# Altium schematic sheet Sheet1.SchDoc
size A; SheetNumber: 1; SheetTotal: 1
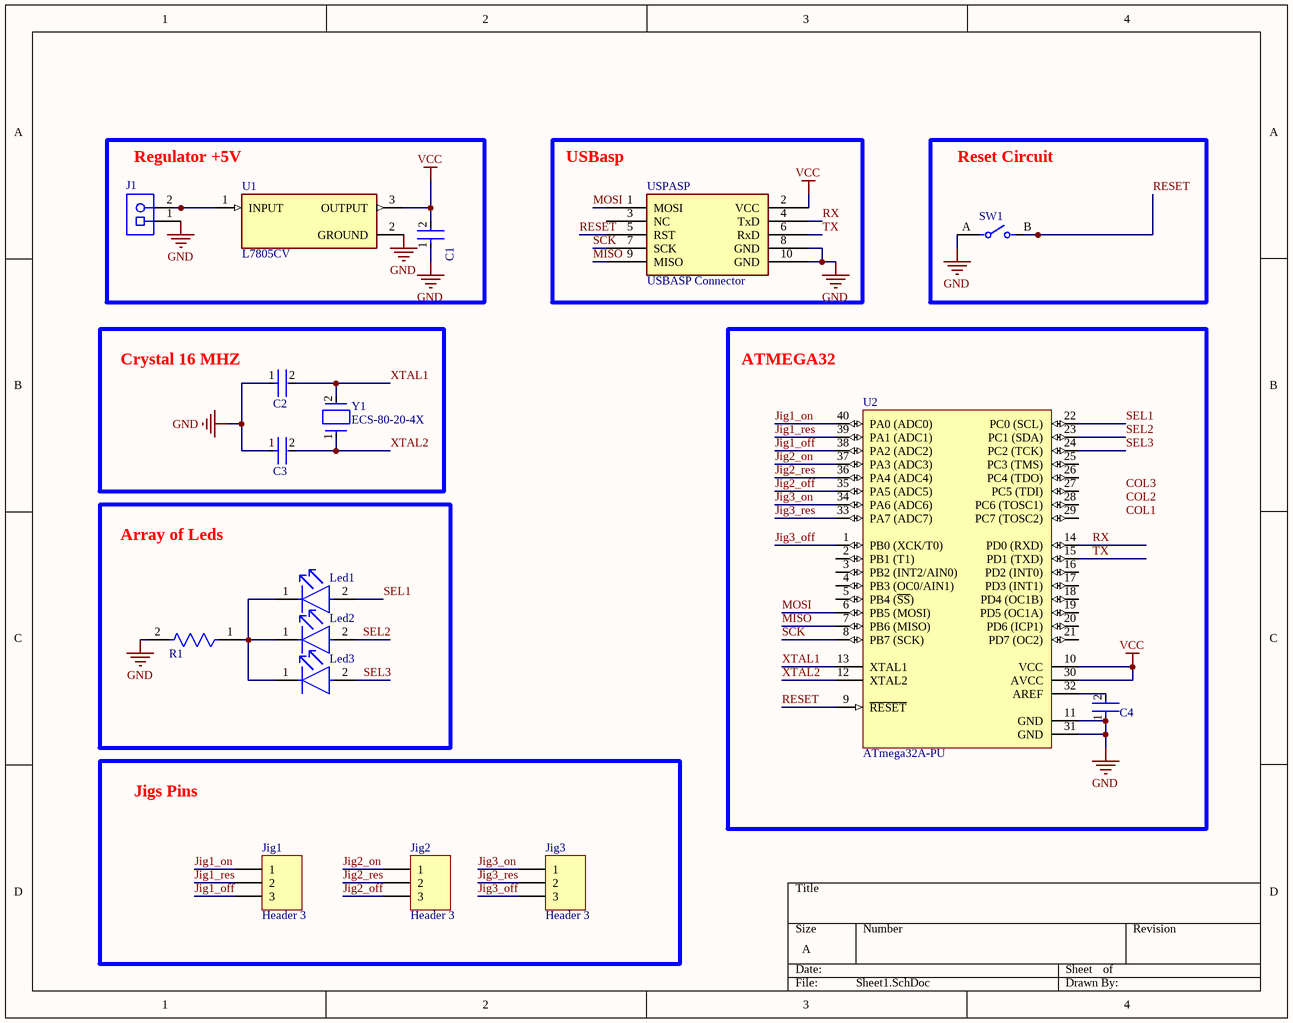
[diagram p0: Sheet1.SchDoc]

## Parts
C1  K103K15X7RF5TL2  [FP-K155L2-MFG]  (value not drawn)
C2  K103K15X7RF5TL2  [FP-K155L2-MFG]  (value not drawn)
C3  K103K15X7RF5TL2  [FP-K155L2-MFG]  (value not drawn)
C4  K103K15X7RF5TL2  [FP-K155L2-MFG]  (value not drawn)
J1  1729128  [PHOE-1729128-2_V]  (value not drawn)
Jig1  Header 3  [HDR1X3]
Jig2  Header 3  [HDR1X3]
Jig3  Header 3  [HDR1X3]
Led1  TLLG4401  [FP-6_544-5255_01-4-MFG]  (value not drawn)
Led2  TLLG4401  [FP-6_544-5255_01-4-MFG]  (value not drawn)
Led3  TLLG4401  [FP-6_544-5255_01-4-MFG]  (value not drawn)
R1  MRS25000C1001FCT00  [FP-MRS25-MFG]  (value not drawn)
SW1  EVQ-21505R  [FP-EVQ-21505R-MFG]  (value not drawn)
U1  L7805CV  [TO255P1040X460X1968-3]
U2  ATmega32A-PU  [40P6]
USPASP  USBASP Connector  [SHDR10W99P254_2X5_2032X889X927P]
Y1  ECS-80-20-4X  [FP-ECS-80-20-4X-MFG]

## Blocks framed on the sheet
Regulator +5V: C1 J1 U1
USBasp: USPASP
Reset Circuit: SW1
Crystal 16 MHZ: C2 C3 Y1
ATMEGA32: C4 U2
Array of Leds: Led1-Led3 R1
Jigs Pins: Jig1-Jig3

## Nets
GND: C1.1 C2.1 C3.1 C4.1 J1.1 R1.2 SW1.A U1.2(GROUND) U2.11(GND) U2.31(GND) USPASP.8(GND) USPASP.10(GND)
VCC: C1.2 U1.3(OUTPUT) U2.10(VCC) U2.30(AVCC) USPASP.2(VCC)
Jig1_off: Jig1.3 U2.38(PA2_(ADC2))
Jig1_on: Jig1.1 U2.40(PA0_(ADC0))
Jig1_res: Jig1.2 U2.39(PA1_(ADC1))
Jig2_off: Jig2.3 U2.35(PA5_(ADC5))
Jig2_on: Jig2.1 U2.37(PA3_(ADC3))
Jig2_res: Jig2.2 U2.36(PA4_(ADC4))
Jig3_off: Jig3.3 U2.1(PB0_(XCK/T0))
Jig3_on: Jig3.1 U2.34(PA6_(ADC6))
Jig3_res: Jig3.2 U2.33(PA7_(ADC7))
MISO: U2.7(PB6_(MISO)) USPASP.9(MISO)
MOSI: U2.6(PB5_(MOSI)) USPASP.1(MOSI)
RESET: SW1.B U2.9(~{RESET}) USPASP.5(RST)
RX: U2.14(PD0_(RXD)) USPASP.4(TxD)
SCK: U2.8(PB7_(SCK)) USPASP.7(SCK)
SEL1: Led1.2(A) U2.22(PC0_(SCL))
SEL2: Led2.2(A) U2.23(PC1_(SDA))
SEL3: Led3.2(A) U2.24(PC2_(TCK))
TX: U2.15(PD1_(TXD)) USPASP.6(RxD)
XTAL1: C2.2 U2.13(XTAL1) Y1.2
XTAL2: C3.2 U2.12(XTAL2) Y1.1
NetC4_2: C4.2 U2.32(AREF)
NetJ1_2: J1.2 U1.1(INPUT)
NetLed1_1: Led1.1(C) Led2.1(C) Led3.1(C) R1.1

Not connected (* = marked no-connect by the designer): U2 2(PB1_(T1)) 3(PB2_(INT2/AIN0)) 4(PB3_(OC0/AIN1)) 5(PB4_(~{SS})) 16(PD2_(INT0)) 17(PD3_(INT1)) 18(PD4_(OC1B)) 19(PD5_(OC1A)) 20(PD6_(ICP1)) 21(PD7_(OC2)) 25(PC3_(TMS)) 26(PC4_(TDO)) 27(PC5_(TDI)) 28(PC6_(TOSC1)) 29(PC7_(TOSC2)); USPASP 3(NC)

## Notes on the sheet
- Labels drawn without touching a wire or pin: COL1, COL2, COL3

## Library data of the parts
C1 C4 = CMP-00030-39474934-1: K103K15X7RF5TL2 Multilayer Ceramic Capacitor, 0.01 uF, 50 V, ± 10%, X7R, Radial Leaded; Voltage: 50V; Lead/Base Style: Straight; Lead Diameter: 500µm; Capacitance: 10nF; Lead Length: 30mm; Case/Package: Dipped; Weight: 160.004709mg; Thickness: 2.6mm; Lead Free: Lead Free; Width: 2.5mm; Min Operating Temperature: -55°C; Lead Pitch: 2.5mm; Voltage Rating: 50V; Dielectric: X7R; Schedule B: 8532240060; Dielectric Material: Ceramic; Number of Pins: 2; Tolerance: 10%; NexarPartId: 39474934; Termination: Radial; Length: 4mm; Radiation Hardening: No; Mount: PCB, Through Hole; Height: 4mm; Diameter: 500µm; Packaging: Cut Tape; Voltage Rating (DC): 50V; Max Operating Temperature: 125°C; REACH SVHC: Unknown; Depth: 2.6mm; RoHS: Compliant; Height - Seated (Max): 5.588mm
C2 C3 = CMP-00030-39474934-1: K103K15X7RF5TL2 Multilayer Ceramic Capacitor, 0.01 uF, 50 V, ± 10%, X7R, Radial Leaded (10P); Voltage: 50V; Lead/Base Style: Straight; Lead Diameter: 500µm; Capacitance: 10nF; Lead Length: 30mm; Case/Package: Dipped; Weight: 160.004709mg; Thickness: 2.6mm; Lead Free: Lead Free; Width: 2.5mm; Min Operating Temperature: -55°C; Lead Pitch: 2.5mm; Voltage Rating: 50V; Dielectric: X7R; Schedule B: 8532240060; Dielectric Material: Ceramic; Number of Pins: 2; Tolerance: 10%; NexarPartId: 39474934; Termination: Radial; Length: 4mm; Radiation Hardening: No; Mount: PCB, Through Hole; Height: 4mm; Diameter: 500µm; Packaging: Cut Tape; Voltage Rating (DC): 50V; Max Operating Temperature: 125°C; REACH SVHC: Unknown; Depth: 2.6mm; RoHS: Compliant; Height - Seated (Max): 5.588mm
J1 = CMP-2000-05815-1: Header of  Input Batt; Manufacturer: Phoenix Contact; Package Version: 03/2015; No. of Rows: 1; Pitch: 5.08mm; No. of Positions: 2; Voltage Rating: 400V; Current Rating: 13500mA; Packing: Bulk; Manufacturer URL: http://www.phoenixcontact.com/; Datasheet URL: https://datasheet.ciiva.com/16046/1729128-16046181.pdf; RoHS: TRUE; Package URL: https://www.phoenixcontact.com/online/portal/pi/pxc/product_detail_page/!ut/p/b1/3VdJjqNKFDxLH8AFycySyWY2ozFsEPOMMQaDOX1XedGL_1Vdm5YXJleknhSKeBkvI6EA8ncAo3AYoDhBQGco6KN7VURTdemj9us_IEKEZo_YHiPAEWEFmDGOHMORkqKYCORBZxgL7ZoaZYcbFFUZ3fqxSY6GOuxydWUuHqz1ynmMFygu583Bob0Ewr6Sd_l-5m-kAueHiB0jpRwZwe58wwtkpxtMYd_LmGcDRU02dRNEyWt6Y2ti5pSyJ_reIkzIulrqApdnbT11V5jnCKbYNCvhEM1MCpPByat_X379-iThf08CI5GfOPqfBeS3BRoBOdD55AKVv0iLwCMq-2BrzXWSGRH7pUGD9uwXQjiph3xL0DKQwdGa0JImiIOmBNOestqgwTHSSs2oOep-78apyXQBvNi8ZLaFjvjWvcaUEBu0MC6Wbe-d6mB0FAebo2lUWinqYaZs5DAYzV0RP9yitUjnGJ0iI9xhZkT42OCQNUJJhkgWINNQLP2JFP6OpMg3JCVg70jqHT0lvKOnhHf0lPuOnnLf0VPuWx6_dxwUIvwk5WMkT0kLL1mh61l2yZVSzG3pYV_bqo-mj6uMKwKwdnnW8Jh5RTOJzMOA5c-eJDaZQw4mTMPH02PvS_ZAqNVjVTo2WyYLkwH_KU1mmmG5kjRhDqPXLwwVHvVOjCM60-fpXvTDfMGW1PVFVS1r4e4yVDk4ZdNbkUHvqPqQSeian4UD39fNKmachqdJ1NJbyk8rXT9mXTvPk3oE5meulKGgiruPJek-4I9hTT6G8ZLOyRSm2RRVbThERQad5OS28hdt4YW4vG0stgYYzsWsK4_7y6DZMjJSCqri1kyiZR5vD7pwIrNR7QwPHTcLTI5qT7eRlpHrdGiupYlqQDJ7zy_CND8fWWBoLRXxk1RVcXiBQwbTD4Xi7KL-FuO94t9xaqweXzH; PartNumber: 1729128; Package Description: 2-Pin Through Hole Device, Body 8.1 x 10.16 mm, Pitch 5.08 mm; Datasheet Version: 12/2013; Mounting Technology: ThroughHole; Orientation: Horizontal; Package Reference: 1729128-2
Jig1-Jig3 = Header 3: Header, 3-Pin; LatestRevisionDate: 17-Jul-2002; LatestRevisionNote: Re-released for DXP Platform.; Publisher: Altium Limited
Led1-Led3 = CMP-00030-39390728-1: TLLG4401 LED, Green, 2mcd, 3mmDia., T-1, +/-25deg, 565nm, 7mA, 1.9V Vf, 20V Vr, 20mW, -40; Test Current: 2mA; Wavelength: 575nm; Number of Elements: 1; Viewing Angle: 25°; Lens Transparency: Diffused; Voltage Rating (DC): 2.4V; Lead Length: 23mm; Max Junction Temperature (Tj): 100°C; Lens Style: Circular, Colored, Diffused, Dome, Round, Tinted; Reverse Voltage: 6V; Forward Voltage: 1.9V; Length: 3.2mm; Forward Current: 2mA; Color: Green; Dominant Wavelength: 575nm; Radiation Hardening: No; NexarPartId: 39390728; Lens Color: Green; REACH SVHC: Unknown; Lead Free: Lead Free; Number of Pins: 2; Luminous Intensity: 2mcd; Schedule B: 8541402000, 8541402000; Max Operating Temperature: 100°C; Illumination Color: Green; Mount: Through Hole; Packaging: Bulk; Depth: 3.2mm; Ambient Temperature Range High: 100°C; Case/Package: Radial; Power Dissipation: 20mW; Height: 4.5mm; RoHS: Compliant; Peak Wavelength: 565nm; Min Operating Temperature: -40°C; Number of LEDs: 1
R1 = CMP-02408-000051-1: RES 1K OHM 0.6W 1% for all leds; Power Rating: 600mW; Lead Diameter: 0.6mm; Voltage Rating (DC): 350V; Resistance: 1kR; Temperature Coefficient: 50ppm/°C; Width: 2.5mm; Military Standard: Not; Package Quantity: 5000; Radiation Hardening: No; Case/Package: Axial; Resistance Tolerance: 1%; Resistor Type: Metal Film; Contact Plating: Tin; Length: 6.5mm; Lead Free: Lead Free; RoHS Compliant: Yes; Mount: Through Hole; Number of Pins: 2; Technology: THIN FILM; Voltage Rating: 350V; Min Operating Temperature: -55°C; Weight: 0.00776oz; Diameter: 2.5mm; Construction: Cylindrical; Series: MRS25; Tolerance: 1%; Packaging: Tape and Reel; Max Operating Temperature: 155°C; Max Power Dissipation: 600mW; Number of Terminations: 2; Termination: Axial
SW1 = CMP-05618-000118-1: Switch for reset circuits; Actuator Length: 1.6mm; Contact Current Rating: 20mA; Actuator Type: Standard; Operating Force: 1.6N; Switch Function: Off-Mom; Mechanical Life: 100000Cycles; Illumination Type: Non-Illuminated; Voltage Rating (DC): 15V; Contact Resistance: 50mR; Actuator Color: Red; Throw Configuration: SPST; Switch Travel: 0.25mm; Termination: PC Pin; Package Quantity: 1; Lead Free: Lead Free; Orientation: Straight; Packaging: Tape and Reel; Series: EVQ2; Min Operating Temperature: -20°C; Max Operating Temperature: 70°C; Width: 6mm; Current Rating: 20mA; Depth: 6mm; Height: 5mm; Contact Plating: Silver; Electrical Life: 100000Cycles; Mount: Through Hole; Max Voltage Rating (DC): 15V; Max Current Rating: 20mA; Length: 6mm; Size: 6mm; Case/Package: Radial
U1 = L7805CV: Linear Voltage Regulator IC Positive Fixed 1 Output 1.5A TO-220; MF: STMicroelectronics; SnapEDA_Link: https://www.snapeda.com/parts/L7805CV/STMicroelectronics/view-part/?ref=snap; Package: TO-220-3 ON Semiconductor; MP: L7805CV; Check_prices: https://www.snapeda.com/parts/L7805CV/STMicroelectronics/view-part/?ref=eda; Purchase-URL: https://pricing.snapeda.com/search/part/L7805CV/?ref=eda; Price: None; Value: *; Availability: In Stock
U2 = CMP-0095-00028-2: 8-bit AVR Microcontroller, 2.7-5.5V, 16MHz, 32KB Flash, 1KB EEPROM, 2KB SRAM, 40-pin PDIP, Industrial Grade (-40°C to 85°C); Code_JEDEC: MS-011-AC; ComponentLink3Description: ATmega32A Summary; PackageVersion: revB, Sep-2001; ComponentLink2Description: ATmega32A Datasheet; ComponentLink3URL: http://www.atmel.com/dyn/resources/prod_documents/8155S.pdf; PackageDescription: 40-lead (0.600"/15.24mm Wide) Plastic Dual Inline Package (PDIP); ComponentLink1Description: Manufacturer URL; PackageReference: 40P6; DatasheetVersion: revC, Feb-2011; ComponentLink2URL: http://www.atmel.com/dyn/resources/prod_documents/doc8155.pdf; RevisionNote: DatasheetVersion updated. URLs added.; ComponentLink1URL: http://www.atmel.com/
USPASP = USBASP Connector: Connector; Manufacturer_Name: Molex; Manufacturer_Part_Number: 70246-1001; Datasheet Link: http://www.molex.com/pdm_docs/sd/702461001_sd.pdf; Height: 9.27mm; Mouser Part Number: 538-70246-1001; Mouser Price/Stock: https://www.mouser.co.uk/ProductDetail/Molex/70246-1001?qs=L7RdmAxh%252BcP9d7Ope9dnAA%3D%3D
Y1 = CMP-1669-00002-3: NexarPartId: 316504; Frequency Stability: 50ppm; ESR (Equivalent Series Resistance): 80Ω; Frequency: 8MHz; Tolerance: 0.003%; Load Capacitance: 20pF; Schedule B: 8541600025, 8541600025; Number of Pins: 49; Max Operating Temperature: 70°C; Lead Free: Lead Free; Height: 3.5mm; Termination: Radial; RoHS: Compliant; Frequency Tolerance: 0.003%; Packaging: Bulk; Mount: Through Hole; Width: 4.65mm; Length: 11.3538mm; Min Operating Temperature: -10°C